# Altium schematic sheet 01_MCU.SchDoc: =GlobalProjectName
size 594 x 420 mm; CheckedBy: A_D; Author: A_D; SheetNumber: 1; SheetTotal: 2; PageSetup: Record=PageOptions|CenterHorizontal=True|CenterVertical=True|PrintScale=0.70|XCorrection=1.00|YCorrection=1.00|PrintKind=2|BorderSize=5000000|LeftOffset=9000|BottomOffset=10100|Orientation=2|PaperLength=11176|PaperWidth=8636|Scale=100|PaperSource=259|PrintQuality=-3|MediaType=1|DitherType=10|PrintScaleMode=1|PaperKind=A3|PaperIndex=8
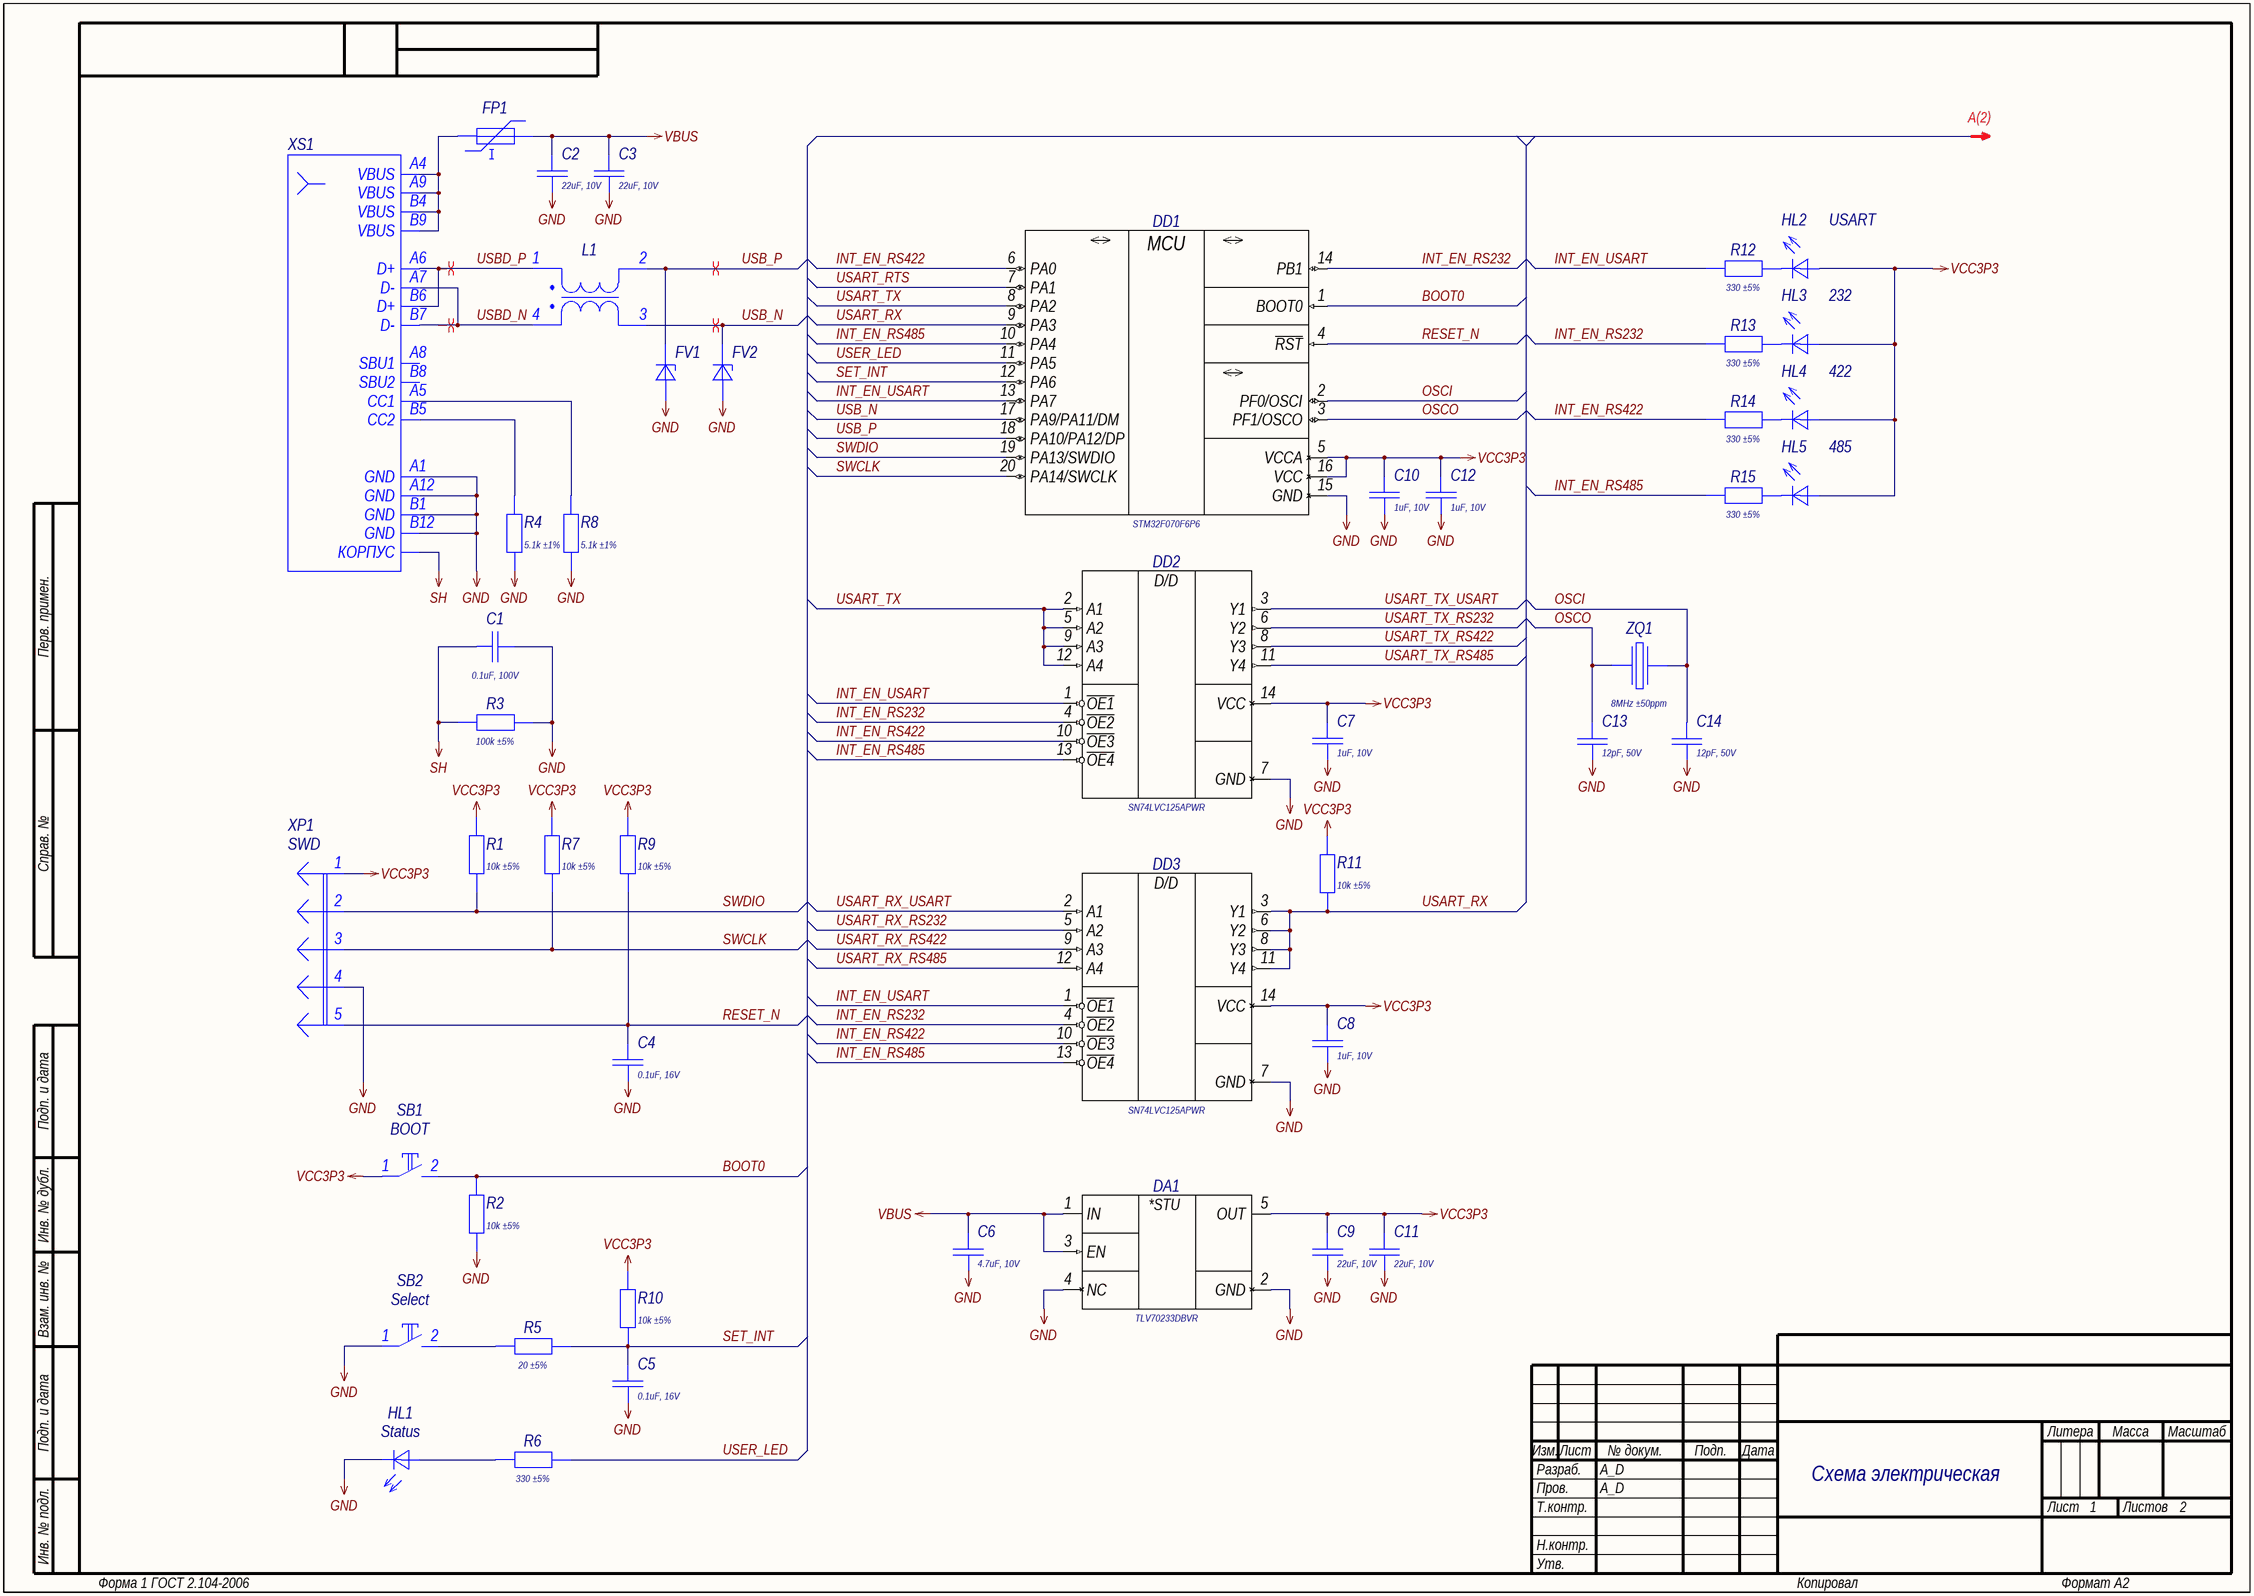
[diagram p0: 01_MCU.SchDoc]

## Parts
C1  Schematic Value: 0.1uF, 100V  [C0603_160X080H080_H]  (hidden comment: Capacitor)
C2  Schematic Value: 22uF, 10V  [C0603_160X080H080_H]  (hidden comment: Capacitor)
C3  Schematic Value: 22uF, 10V  [C0603_160X080H080_H]  (hidden comment: Capacitor)
C4  Schematic Value: 0.1uF, 16V  [C0402_100X050H050_H]  (hidden comment: Capacitor)
C5  Schematic Value: 0.1uF, 16V  [C0402_100X050H050_H]  (hidden comment: Capacitor)
C6  Schematic Value: 4.7uF, 10V  [C0402_100X050H050_H]  (hidden comment: Capacitor)
C7  Schematic Value: 1uF, 10V  [C0402_100X050H050_H]  (hidden comment: Capacitor)
C8  Schematic Value: 1uF, 10V  [C0402_100X050H050_H]  (hidden comment: Capacitor)
C9  Schematic Value: 22uF, 10V  [C0603_160X080H080_H]  (hidden comment: Capacitor)
C10  Schematic Value: 1uF, 10V  [C0402_100X050H050_H]  (hidden comment: Capacitor)
C11  Schematic Value: 22uF, 10V  [C0603_160X080H080_H]  (hidden comment: Capacitor)
C12  Schematic Value: 1uF, 10V  [C0402_100X050H050_H]  (hidden comment: Capacitor)
C13  Schematic Value: 12pF, 50V  [C0402_100X050H050_H]  (hidden comment: Capacitor)
C14  Schematic Value: 12pF, 50V  [C0402_100X050H050_H]  (hidden comment: Capacitor)
DA1  Schematic Value: TLV70233DBVR  [SOT-23-5_095P290X160X145_N]  (hidden comment: TLV702xxPDBV-Series)
DD1  Schematic Value: STM32F070F6P6  [TSSOP-20_065P650X440X120_N]  (hidden comment: STM32F070FxPx-Series)
DD2  Schematic Value: SN74LVC125APWR  [TSSOP-14_065P500X440X120_N]  (hidden comment: SN74LVC125APW)
DD3  Schematic Value: SN74LVC125APWR  [TSSOP-14_065P500X440X120_N]  (hidden comment: SN74LVC125APW)
FP1  Fuse_PTC  [F0603_160X080H075_H]  (value not drawn)
FV1  Suppressor_21  [X1-DFN1006-2_070P060X100X050_N]  (value not drawn)
FV2  Suppressor_21  [X1-DFN1006-2_070P060X100X050_N]  (value not drawn)
HL1  Status  [LD0603_L]
HL2  USART  [LD0603_L]
HL3  232  [LD0603_L]
HL4  422  [LD0603_L]
HL5  485  [LD0603_L]
L1  Coil-2xCommon_H  [DLW21HN-Series]  (value not drawn)
R1  Schematic Value: 10k ±5%  [R0402_100X050H035_H]  (hidden comment: Resistor)
R2  Schematic Value: 10k ±5%  [R0402_100X050H035_H]  (hidden comment: Resistor)
R3  Schematic Value: 100k ±5%  [R0402_100X050H035_H]  (hidden comment: Resistor)
R4  Schematic Value: 5.1k ±1%  [R0402_100X050H035_H]  (hidden comment: Resistor)
R5  Schematic Value: 20 ±5%  [R0402_100X050H035_H]  (hidden comment: Resistor)
R6  Schematic Value: 330 ±5%  [R0402_100X050H035_H]  (hidden comment: Resistor)
R7  Schematic Value: 10k ±5%  [R0402_100X050H035_H]  (hidden comment: Resistor)
R8  Schematic Value: 5.1k ±1%  [R0402_100X050H035_H]  (hidden comment: Resistor)
R9  Schematic Value: 10k ±5%  [R0402_100X050H035_H]  (hidden comment: Resistor)
R10  Schematic Value: 10k ±5%  [R0402_100X050H035_H]  (hidden comment: Resistor)
R11  Schematic Value: 10k ±5%  [R0402_100X050H035_H]  (hidden comment: Resistor)
R12  Schematic Value: 330 ±5%  [R0402_100X050H035_H]  (hidden comment: Resistor)
R13  Schematic Value: 330 ±5%  [R0402_100X050H035_H]  (hidden comment: Resistor)
R14  Schematic Value: 330 ±5%  [R0402_100X050H035_H]  (hidden comment: Resistor)
R15  Schematic Value: 330 ±5%  [R0402_100X050H035_H]  (hidden comment: Resistor)
SB1  BOOT  [IT-1185AP]
SB2  Select  [IT-1185AP]
XP1  SWD  [PLS-5]
XS1  Text  [U262-161N-4BVC11]  (value not drawn)
ZQ1  Schematic Value: 8MHz ±50ppm  [SMD 5x3.2mm]  (hidden comment: Crystal)

## Nets
GND: C1.1 C2.2 C3.2 C4.2 C5.2 C6.1 C7.2 C8.2 C9.1 C10.2 C11.1 C12.2 C13.1 C14.1 DA1.2(GND) DA1.4(NC) DD1.15(GND) DD2.7(GND) DD3.7(GND) FV1.2(А) FV2.2(А) HL1.2 R2.1 R3.1 R4.1 R8.1 SB2.1 XP1.4 XS1.A1(GND) XS1.A12(GND) XS1.B1(GND) XS1.B12(GND)
SH: C1.2 R3.2 XS1.SH(КОРПУС)
VBUS: C2.1 C3.1 C6.2 DA1.1(IN) DA1.3(EN) FP1.2
VCC3P3: C7.1 C8.1 C9.2 C10.1 C11.2 C12.1 DA1.5(OUT) DD1.5(VCCA) DD1.16(VCC) DD2.14(VCC) DD3.14(VCC) HL2.1 HL3.1 HL4.1 HL5.1 R1.2 R7.2 R9.2 R10.2 R11.2 SB1.1 XP1.1
BOOT0: DD1.1(BOOT0) R2.2 SB1.2
INT_EN_RS232: DD1.14(PB1) DD2.4(~{OE2}) DD3.4(~{OE2}) R13.2
INT_EN_RS422: DD1.6(PA0) DD2.10(~{OE3}) DD3.10(~{OE3}) R14.2
INT_EN_RS485: DD1.10(PA4) DD2.13(~{OE4}) DD3.13(~{OE4}) R15.2
INT_EN_USART: DD1.13(PA7) DD2.1(~{OE1}) DD3.1(~{OE1}) R12.2
OSCI: C14.2 DD1.2(PF0/OSCI) ZQ1.3
OSCO: C13.2 DD1.3(PF1/OSCO) ZQ1.1
RESET_N: C4.1 DD1.4(~{RST}) R9.1 XP1.5
SET_INT: C5.1 DD1.12(PA6) R5.1 R10.1
SWCLK: DD1.20(PA14/SWCLK) R7.1 XP1.3
SWDIO: DD1.19(PA13/SWDIO) R1.1 XP1.2
USART_RTS: DD1.7(PA1)
USART_RX: DD1.9(PA3) DD3.3(Y1) DD3.6(Y2) DD3.8(Y3) DD3.11(Y4) R11.1
USART_RX_RS232: DD3.5(A2)
USART_RX_RS422: DD3.9(A3)
USART_RX_RS485: DD3.12(A4)
USART_RX_USART: DD3.2(A1)
USART_TX: DD1.8(PA2) DD2.2(A1) DD2.5(A2) DD2.9(A3) DD2.12(A4)
USART_TX_RS232: DD2.6(Y2)
USART_TX_RS422: DD2.8(Y3)
USART_TX_RS485: DD2.11(Y4)
USART_TX_USART: DD2.3(Y1)
USB_N: DD1.17(PA9/PA11/DM) FV2.1(К) L1.3
USB_P: DD1.18(PA10/PA12/DP) FV1.1(К) L1.2
USBD_N: L1.4 XS1.A7(D-) XS1.B7(D-)
USBD_P: L1.1 XS1.A6(D+) XS1.B6(D+)
USER_LED: DD1.11(PA5) R6.1
NetFP1_1: FP1.1 XS1.A4(VBUS) XS1.A9(VBUS) XS1.B4(VBUS) XS1.B9(VBUS)
NetHL1_1: HL1.1 R6.2
NetHL2_2: HL2.2 R12.1
NetHL3_2: HL3.2 R13.1
NetHL4_2: HL4.2 R14.1
NetHL5_2: HL5.2 R15.1
NetR4_2: R4.2 XS1.B5(CC2)
NetR5_2: R5.2 SB2.2
NetR8_2: R8.2 XS1.A5(CC1)

Not connected (* = marked no-connect by the designer): XS1 A8(SBU1) B8(SBU2)

## Layout directives
differential pair: USB_N, USB_P, USBD_N, USBD_P

## Notes on the sheet
- А(2)
- Схема электрическая
  принципиальная
- Перв. примен.
- Справ. №
- Подп. и дата
- Инв. № дубл.
- Взам. инв. №
- Разраб.
- Изм.
- Лист
- № докум.
- Подп.
- Дата
- Литера
- Масса
- Масштаб
- Пров.
- Т.контр.
- Листов
- Инв. № подл.
- Н.контр.
- Утв.
- Форма 1 ГОСТ 2.104-2006
- Копировал
- Формат А2
- (in symbol SN74LVC125APWR) D/D
- (in symbol STM32F070F6P6) MCU
- (in symbol TLV70233DBVR) *STU

## Library data of the parts
C1 = GRM188R72A104KA35D: Manufacturer: Murata; Type: Конденсатор; ID: 232; Value: 0.1uF; Voltage: 100V; Tolerance: ±10%; Dielectric Type: X7R; Application Category: 1; Working Temperature Min: -55°С; Working Temperature Max: +125°С; Functional Analog: GRM188R72A104KA35J; Published: 18.05.2010; Publisher: Andrew Danich; Part Number: GRM188R72A104KA35D; Footprint: 0603; LCSC Part: C113803
C2 C3 C9 C11 = GRM188R61A226ME15D: Manufacturer: Murata; Type: Конденсатор; ID: 256; Value: 22uF; Voltage: 10V; Tolerance: ±20%; Dielectric Type: X5R; Application Category: 1; Working Temperature Min: -55°С; Working Temperature Max: +85°С; Functional Analog: GRM188R61A226ME15J; Published: 18.05.2010; Publisher: Andrew Danich; Part Number: GRM188R61A226ME15D; Footprint: 0603
C4 C5 = GCM155R71C104KA55D: Manufacturer: Murata; Type: Конденсатор; ID: 163; Value: 0.1uF; Voltage: 16V; Tolerance: ±10%; Dielectric Type: X7R; Application Category: 1; Working Temperature Min: -55°С; Working Temperature Max: +125°С; Functional Analog: GRM155R71C104KA88D, GCM155R71C104KA55J, GCM155R71C104KA55W; Published: 18.05.2010; Publisher: Andrew Danich; Part Number: GCM155R71C104KA55D; Footprint: 0402
C6 = GRM155R61A475MEAAD: Manufacturer: Murata; Type: Конденсатор; ID: 255; Value: 4.7uF; Voltage: 10V; Tolerance: ±20%; Dielectric Type: X5R; Application Category: 1; Working Temperature Min: -55°С; Working Temperature Max: +85°С; Functional Analog: GRM155R61A475MEAAJ; Published: 18.05.2010; Publisher: Andrew Danich; Part Number: GRM155R61A475MEAAD; Footprint: 0402
C7 C8 C10 C12 = GRM155C71A105KE11D: Manufacturer: Murata; Type: Конденсатор; ID: 179; Value: 1uF; Voltage: 10V; Tolerance: ±10%; Dielectric Type: X7S; Application Category: 1; Working Temperature Min: -55°С; Working Temperature Max: +125°С; Functional Analog: GRM155C71A105KE11J; Published: 18.05.2010; Publisher: Andrew Danich; Part Number: GRM155C71A105KE11D; Footprint: 0402
C13 C14 = GRM1555C1H120JA01D: Manufacturer: Murata; Type: Конденсатор; ID: 159; Value: 12pF; Voltage: 50V; Tolerance: ±5%; Dielectric Type: NP0; Application Category: 1; Working Temperature Min: -55°С; Working Temperature Max: +125°С; Functional Analog: GJM1555C1H120GB01D, GRM1555C1H120JA01J, GRM1555C1H120JA01W; Published: 18.05.2010; Publisher: Andrew Danich; Part Number: GRM1555C1H120JA01D; Footprint: 0402
DA1 = TLV70233DBVR: Manufacturer: Texas Instruments; ID: 47; Input Voltage: +3.55…5.5V; Output Current: 300mA; Output Voltage: +3.3V; Application Category: 1; Working Temperature Min: -40°С; Working Temperature Max: +125°С; Functional Analog: TLV70233DBVT; Published: 23.05.2020; Publisher: Andrew Danich; Type: Микросхема; Part Number: TLV70233DBVR; Value: TLV70233DBVR; LCSC Part: C26833
DD1 = STM32F070F6P6: Manufacturer: STMicroelectronics; ID: 22; Supply Operation: +2.4…3.6V; Flash: 32K; SRAM: 6K; Prog Interface: SWD; I/O Lines: 15; Operation Frequency: 48MHz; Application Category: 1; Working Temperature Min: -40°С; Working Temperature Max: +85°С; Published: 02.02.2017; Publisher: Andrew Danich; Type: Микросхема; Part Number: STM32F070F6P6; Value: STM32F070F6P6
DD2 DD3 = SN74LVC125APWR: Manufacturer: Texas Instruments; ID: 31; Supply Operation: +1.65…3.6V; Supply Current: 20uA; Output Current: 24mA; Elements: 4; Propagation Delay: 4.8nS; Series Type: 4-Bit Bus Buffer Gate With 3-State Outputs; Application Category: 1; Working Temperature Min: -40°С; Working Temperature Max: +125°С; Functional Analog: SN74LVC125APWT; Type: Микросхема; Published: 13.08.2022; Publisher: Andrew Danich; Part Number: SN74LVC125APWR; Value: SN74LVC125APWR; LCSC Part: C7813
FP1 = 0603L100SLYR: Manufacturer: Littelfuse; ID: 13; Limit Voltage: 6V; Hold Current: 1A; Resistance: 0.12ohm; Trip Current: 1.8A; Current Rating Max: 50A; Application Category: 1; Working Temperature Min: -40°С; Working Temperature Max: +85°С; Published: 25.0.2017; Type: Предохранитель самовосстанавливающийся; Part Number: 0603L100SLYR; Value: 0603L100SLYR
FV1 FV2 = PESDUC2FD5VU: Manufacturer: Shanghai Prisemi Elec; ID: 49; Breakdown Voltage: 7.0V; Reverse Stand Off Voltage: 5.0V; Forward Voltage: 1.25V; Junction Capacitance: 0.65pF; Pulse Power Dissipation: 100W; Directional: Unidirectional; Application Category: 1; Working Temperature Min: -55°С; Working Temperature Max: +125°С; Published: 27.07.2015; Publisher: Andrew Danich; Type: Супрессор; Schematic Value: PESDUC2FD5VU; Part Number: PESDUC2FD5VU; Value: PESDUC2FD5VU; LCSC Part: C496534
HL1 = NCD0603G1: Manufacturer: Foshan NationStar Optoelectronics; Type: Индикатор единичный; ID: 45; Forward Voltage: 3.0V; Forward Current: 20mA; Power Dissipation: 72mW; Luminous Flux: 650; Color: Green; Leds: 1; Working Temperature Min: -30°С; Working Temperature Max: +85°С; Published: 03.12.2013; Publisher: Andrew Danich; Part Number: NCD0603G1; Value: NCD0603G1; Footprint: 0603; Application Category: 1; LCSC Part: C84267
HL2-HL5 = NCD0603W1: Manufacturer: Foshan NationStar Optoelectronics; Type: Индикатор единичный; ID: 44; Forward Voltage: 2.8V; Forward Current: 20mA; Power Dissipation: 72mW; Luminous Flux: 250; Color: White; Leds: 1; Working Temperature Min: -30°С; Working Temperature Max: +85°С; Published: 03.12.2013; Publisher: Andrew Danich; Part Number: NCD0603W1; Value: NCD0603W1; Footprint: 0603; Application Category: 1; LCSC Part: C84265
L1 = DLW21HN121SQ2L: Manufacturer: Murata; Type: Дроссель; ID: 6; Rated Current: 280mA; Rated Voltage: 50V; Common Mode Impedance at 100MHz: 120ohm; Insulation Resistance: 10meg; DC Resistance: 0.45ohm; Withstand Voltage: 125V; Application Category: 1; Working Temperature Min: -40°С; Working Temperature Max: +85°С; Functional Analog: DLW21HN121SQ2B; Published: 04.09.2015; Publisher: Andrew Danich; Schematic Value: =Inductance+' '+Tolerance+', '+"Rated Current"; Part Number: DLW21HN121SQ2L; Value: DLW21HN121SQ2L
R1 R2 R7 R9-R11 = RC0402JR-0710KL: Manufacturer: Yageo; ID: 476; Value: 10k; Limit Voltage: 50V; Tolerance: ±5%; Temperature Coefficient: 100ppm; Total Power Dissipation: 0.1W; Series Type: Thick-Film; Application Category: 1; Working Temperature Min: -55°С; Working Temperature Max: +155°С; Type: Резистор; Published: 24.03.2010; Publisher: Andrew Danich; Part Number: RC0402JR-0710KL; Footprint: 0402; LCSC Part: C25744
R3 = RC0402JR-07100KL: Manufacturer: Yageo; ID: 351; Value: 100k; Limit Voltage: 50V; Tolerance: ±5%; Temperature Coefficient: 100ppm; Total Power Dissipation: 0.1W; Series Type: Thick-Film; Application Category: 1; Working Temperature Min: -55°С; Working Temperature Max: +155°С; Type: Резистор; Published: 24.03.2010; Publisher: Andrew Danich; Part Number: RC0402JR-07100KL; Footprint: 0402; LCSC Part: C25741
R4 R8 = RC0402FR-075K1L: Manufacturer: Yageo; ID: 496; Value: 5.1k; Limit Voltage: 50V; Tolerance: ±1%; Temperature Coefficient: 100ppm; Total Power Dissipation: 0.1W; Series Type: Thick-Film; Application Category: 1; Working Temperature Min: -55°С; Working Temperature Max: +155°С; Type: Резистор; Published: 24.03.2010; Publisher: Andrew Danich; Part Number: RC0402FR-075K1L; Footprint: 0402
R5 = RC0402JR-0720RL: Manufacturer: Yageo; ID: 369; Value: 20; Limit Voltage: 50V; Tolerance: ±5%; Temperature Coefficient: 100ppm; Total Power Dissipation: 0.1W; Series Type: Thick-Film; Application Category: 1; Working Temperature Min: -55°С; Working Temperature Max: +155°С; Type: Резистор; Published: 24.03.2010; Publisher: Andrew Danich; Part Number: RC0402JR-0720RL; Footprint: 0402
R6 R12-R15 = RC0402JR-07330RL: Manufacturer: Yageo; ID: 478; Value: 330; Limit Voltage: 50V; Tolerance: ±5%; Temperature Coefficient: 100ppm; Total Power Dissipation: 0.1W; Series Type: Thick-Film; Application Category: 1; Working Temperature Min: -55°С; Working Temperature Max: +155°С; Type: Резистор; Published: 24.03.2010; Publisher: Andrew Danich; Part Number: RC0402JR-07330RL; Footprint: 0402
SB1 SB2 = IT-1185AP: ID: 36; Limit Current: 50mA; Resistance: 0.1ohm; Isolator Resistance: 100meg; Backlight: NO; Number of Contacts: 2; Application Category: 1; Published: 17.04.2014; Publisher: Andrew Danich; Type: Переключатель; Schematic Value: IT-1185AP; Part Number: IT-1185AP; Value: IT-1185AP; Height: 5mm
XP1 = PLS-5: ID: 4; Value: PLS-5; Limit Voltage: 250V; Limit Current: 3A; Connector Type: Male; Resistance: 15momh; Surface Finish: Gold; Pitch: 2.54mm; Application Category: 1; Published: 07.03.2013; Publisher: Andrew Danich; Type: Вилка; Schematic Value: PLS-5; Part Number: PLS-5; Pins: 5
XS1 = U262-161N-4BVC11: Manufacturer: XKB Enterprise; ID: 41; Limit Voltage: 30V; Limit Current: 3A; Connector Type: Female; Interface: USB 3.1 Type C; Max Data Rate: 5 Gbps; Application Category: 1; Working Temperature Min: -40°С; Working Temperature Max: +85°С; Functional Analog: C167321; Published: 17.09.2018; Publisher: Andrew Danich; Type: Розетка; Part Number: U262-161N-4BVC11; Value: U262-161N-4BVC11; Pins: 16; Mount Type: Surface
ZQ1 = KX-9A 8.0 MHz 30/50/100 16 pF: Manufacturer: Geyer; ID: 12; Output Frequency: 8MHz; Shunt Capacitance: 5pF; Load Capacitance: 16pF; Temperature Coefficient: ±50ppm; Application Category: 1; Working Temperature Min: -20°С; Working Temperature Max: +70°С; Published: 08.03.2013; Publisher: Andrew Danich; Type: Резонатор; Part Number: KX-9A 8.0 MHz 30/50/100 16 pF; Value: KX-9A 8.0 MHz 30/50/100 16 pF